# Altium schematic sheet HCP_Single_Ended.SchDoc
size A4
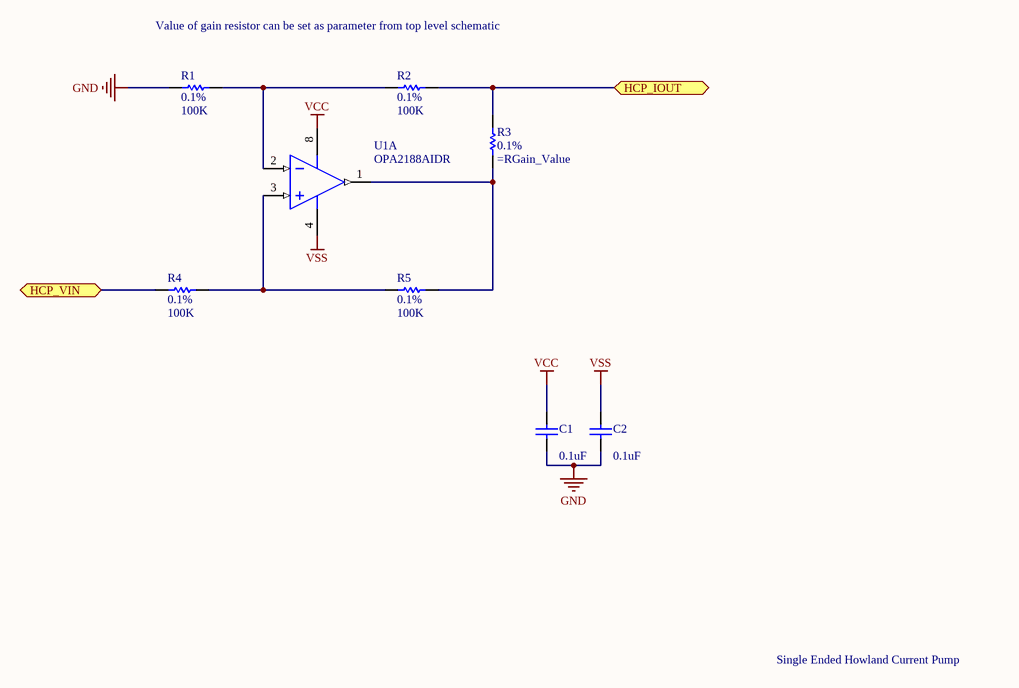
[diagram p0: HCP_Single_Ended.SchDoc]

## Parts
C1  value 0.1uF  [1608[0603]]  (hidden comment: Cap Semi)
C2  value 0.1uF  [1608[0603]]  (hidden comment: Cap Semi)
R1  0.1%  value 100K  [6-0805_M]
R2  0.1%  value 100K  [6-0805_M]
R3  0.1%  [6-0805_M]
R4  0.1%  value 100K  [6-0805_M]
R5  0.1%  value 100K  [6-0805_M]
U1  OPA2188AIDR  [D0008A_L]  (part A of 2)

## Ports
HCP_IOUT (bidir), HCP_VIN (bidir)

## Nets
GND: C1.1 C2.1 R1.1
VCC: C1.2 U1.8(V+)
VSS: C2.2 U1.4(V-)
HCP_IOUT: R2.2 R3.2 ; port HCP_IOUT
HCP_VIN: R4.1 ; port HCP_VIN
NetR1_2: R1.2 R2.1 U1.2(IN_A-)
NetR3_1: R3.1 R5.2 U1.1(OUT_A)
NetR4_2: R4.2 R5.1 U1.3(IN_A+)

## Notes on the sheet
- Value of gain resistor can be set as parameter from top level schematic
- Single Ended Howland Current Pump

## Library data of the parts
C1 C2 = Cap Semi: Capacitor (Semiconductor SIM Model); Published: 8-Jun-2000; LatestRevisionDate: 29-May-2009; LatestRevisionNote: IPC-7351 Footprint Added.; PackageReference: C1206; Publisher: Altium Limited; PackageDescription: Chip Capacitor
R1-R5 = Res1: Resistor; Published: 8-Jun-2000; LatestRevisionDate: 17-Jul-2002; LatestRevisionNote: Re-released for DXP Platform.; PackageReference: AXIAL-0.3; Publisher: Altium Limited; PackageDescription: Axial Device, Thru-Hole; 2 Leads; 0.3 in Pin Spacing
  R3: Value: =RGain_Value
U1 = CMP-0272-00241-3: 0.03 uV/degC, 6 uV Vos, Low Noise, Rail-to-Rail Output, Zero-Drift Operational Amplifier, 4 to 36 V, -40 to 105 degC, 8-pin SOIC (D8), Green (RoHS & no Sb/Br); Manufacturer: Texas Instruments; Rating: Catalog; Number of Channels: 2; CMRR(Min)(dB): 120; Total Supply Voltage(Max)(+5V is 5, +/-5V is 10): 36; Packing: LARGE T&R; Slew Rate(Typ)(V/us): 0.8; Iq per channel(Max)(mA): 0.475; Vio (25C)(Max)(mV): 0.025; IIB(Max)(pA): 850; Offset Drift(Typ)(uV/C): 0.03; Sub Family: High Supply Voltage Amplifier (>=30V), Low Noise Amp (<=10nV/rtHz), Low Offset Voltage Amplifier (<=500uV), Low Power Amp (<=500uA), Precision Amplifier, Zero Drift Precision Amplifier; Total Supply Voltage(Min)(+5V is 5, +/-5V is 10): 4; Mounting Technology: Surface Mount; Code_JEDEC: MS-012; ComponentLink2Description: Datasheet; DatasheetVersion: SBOS525B; ComponentLink1URL: http://www.ti.com/; GBW(Typ)(MHz): 2; Eco-Plan: Green (RoHS & no Sb/Br); PackageVersion: 4040047-3/M, 06/2011; ComponentLink3Description: Package Specification; ComponentLink1Description: Manufacturer URL; PartNumber: OPA2188AIDR; ComponentLink2URL: http://www.ti.com/lit/ds/symlink/opa2188.pdf; ComponentLink3URL: http://www.ti.com/litv/pdf/msoi002j; PackageReference: D0008A; PackageDescription: 8-Pin Plastic Small Outline, Body 4.9 x 3.9 mm, Pitch 1.27 mm; PartId: 1